# Altium schematic sheet Control Connector.SchDoc
size B; Author: E. Sims; Organization: Let's Build Rockets Inc.; SheetNumber: 8; SheetTotal: 8
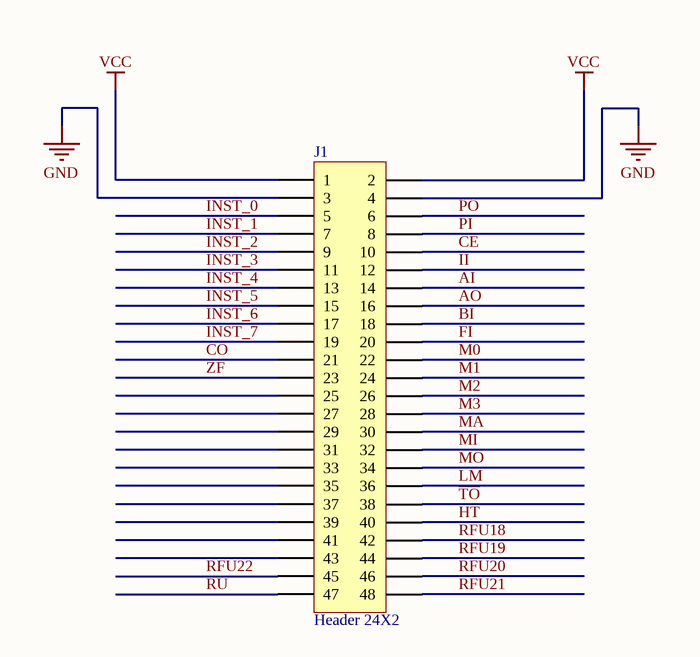
[diagram p0: Control Connector.SchDoc]

## Parts
J1  Header 24X2  [HDR2X24]

## Nets
GND: J1.3 J1.4
VCC: J1.1 J1.2
~{AI}: J1.14
~{AO}: J1.16
~{BI}: J1.18
~{CE}: J1.10
CO: J1.21
~{FI}: J1.20
HT: J1.40
~{II}: J1.12
INST_0: J1.5
INST_1: J1.7
INST_2: J1.9
INST_3: J1.11
INST_4: J1.13
INST_5: J1.15
INST_6: J1.17
INST_7: J1.19
LM: J1.36
M0: J1.22
M1: J1.24
M2: J1.26
M3: J1.28
~{MA}: J1.30
~{MO}: J1.34
MI: J1.32
~{PI}: J1.8
~{PO}: J1.6
RFU18: J1.42
RFU19: J1.44
RFU20: J1.46
RFU21: J1.48
RFU22: J1.45
RU: J1.47
~{TO}: J1.38
ZF: J1.23

Not connected (* = marked no-connect by the designer): J1 25 27 29 31 33 35 37 39 41 43

## Notes on the sheet
- Let's Build Rocket's Inc. Modular Paylaod System Based on TMP-010 Rev
  For more information visit https://github.com/LetsBuildRockets/Modular-Payload-System
  This work is licensed under CC BY-NC 4.0. To view a copy of this license, visit https://creativecommons.org/licenses/by-nc/4.0
- Title
- Size:
- Date:
- Assembly Variant:
- B
- Number:
- Time:
- Revision:
- Sheet
- of
- Author:
- File:

## Library data of the parts
J1 = Header 24X2: Header, 24-Pin, Dual row; LatestRevisionDate: 17-Jul-2002; LatestRevisionNote: Re-released for DXP Platform.; Publisher: Altium Limited